# EAGLE design PCA9622DR (EAGLE 7.5.0)
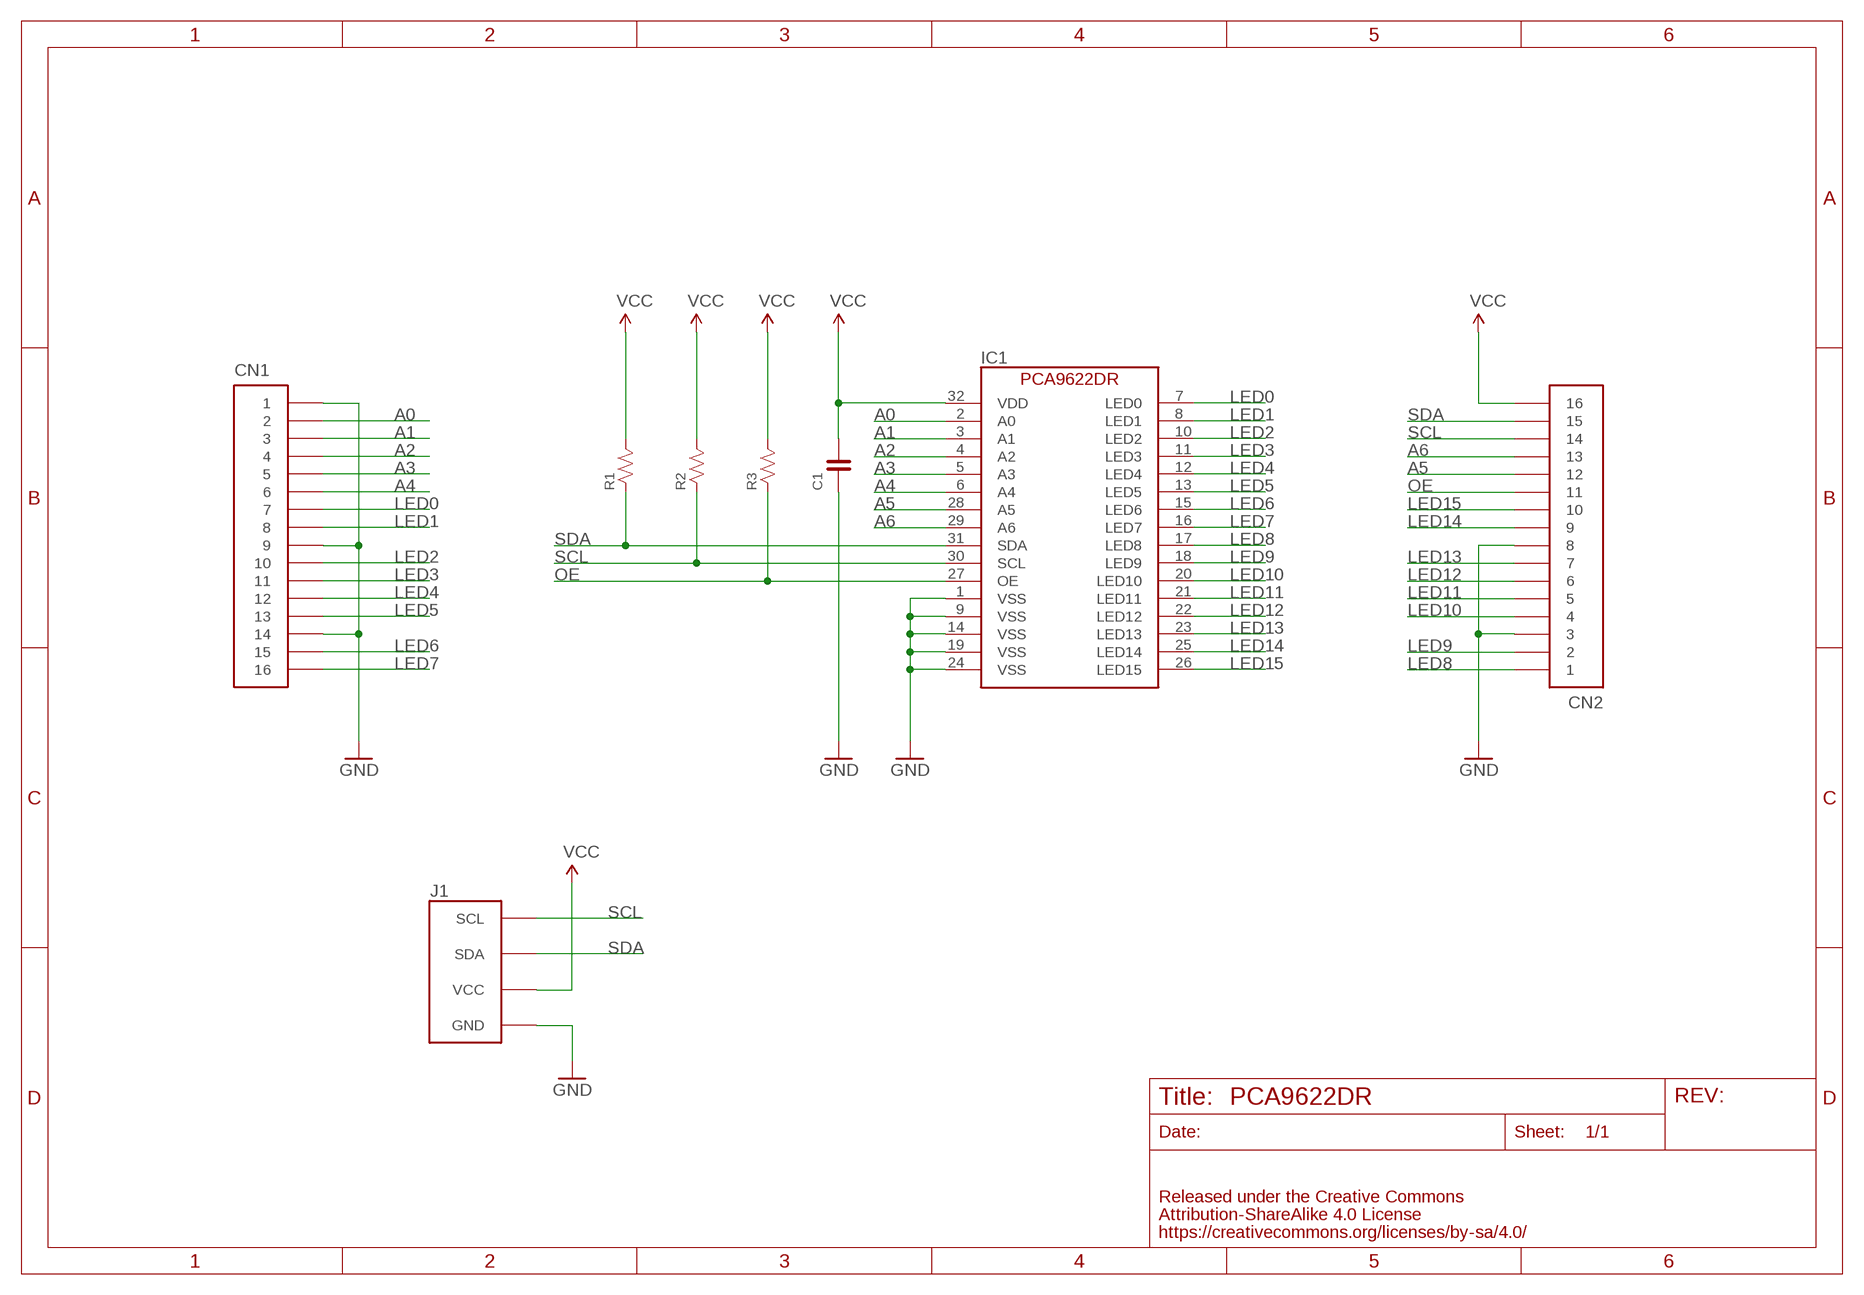
[diagram p0: schematic, sheet 1]

## Parts
C1  CAPACITOR-0603  [0603]
CN1  PIN_HEADER_1X16  [PIN_1X16_SNEAKY]
CN2  PIN_HEADER_1X16  [PIN_1X16_SNEAKY]
IC1  PCA9622DR  [TSSOP32]
J1  FABO_BRICK_I2C-CONNECTOR  [FABO_BRICK_I2C_CONNECTOR]
R1  RESISTOR-0603  [0603]
R2  RESISTOR-0603  [0603]
R3  RESISTOR-0603  [0603]

## Nets
A0: CN1.2 IC1.2(A0)
A1: CN1.3 IC1.3(A1)
A2: CN1.4 IC1.4(A2)
A3: CN1.5 IC1.5(A3)
A4: CN1.6 IC1.6(A4)
A5: CN2.12 IC1.28(A5)
A6: CN2.13 IC1.29(A6)
GND: C1.1 CN1.1 CN1.9 CN1.14 CN2.3 CN2.8 IC1.1(VSS) IC1.9(VSS) IC1.14(VSS) IC1.19(VSS) IC1.24(VSS) J1.GND
LED0: CN1.7 IC1.7(LED0)
LED1: CN1.8 IC1.8(LED1)
LED2: CN1.10 IC1.10(LED2)
LED3: CN1.11 IC1.11(LED3)
LED4: CN1.12 IC1.12(LED4)
LED5: CN1.13 IC1.13(LED5)
LED6: CN1.15 IC1.15(LED6)
LED7: CN1.16 IC1.16(LED7)
LED8: CN2.1 IC1.17(LED8)
LED9: CN2.2 IC1.18(LED9)
LED10: CN2.4 IC1.20(LED10)
LED11: CN2.5 IC1.21(LED11)
LED12: CN2.6 IC1.22(LED12)
LED13: CN2.7 IC1.23(LED13)
LED14: CN2.9 IC1.25(LED14)
LED15: CN2.10 IC1.26(LED15)
OE: CN2.11 IC1.27(OE) R3.1
SCL: CN2.14 IC1.30(SCL) J1.SCL R2.1
SDA: CN2.15 IC1.31(SDA) J1.SDA R1.1
VCC: C1.2 CN2.16 IC1.32(VDD) J1.VCC R1.2 R2.2 R3.2

## Library data of the parts
C1 = FaBo-Capacitor:CAPACITOR: CAPACITOR
CN1 CN2 = FaBo-PIN:PIN_HEADER_1X16
IC1 = FaBo-LED:PCA9622DR
J1 = FaBo-Template:FABO_BRICK_I2C: FaBo Brick I2C
R1-R3 = FaBo-Resistors:RESISTOR: RESISTOR

## Board
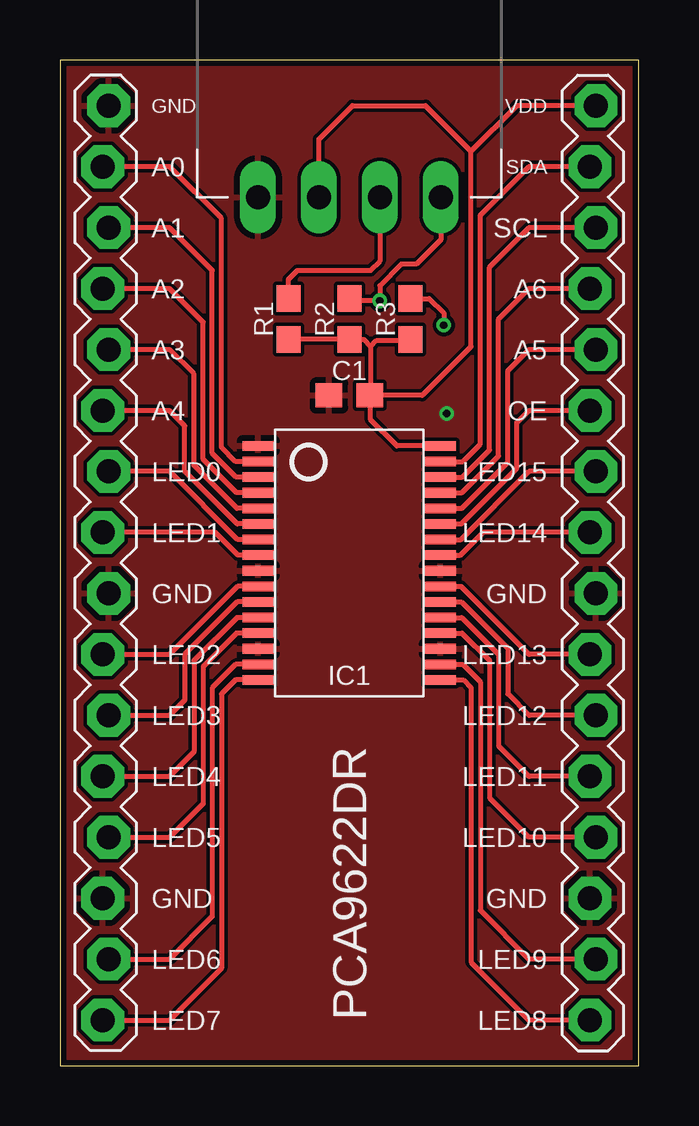
[diagram p1: board, top side]
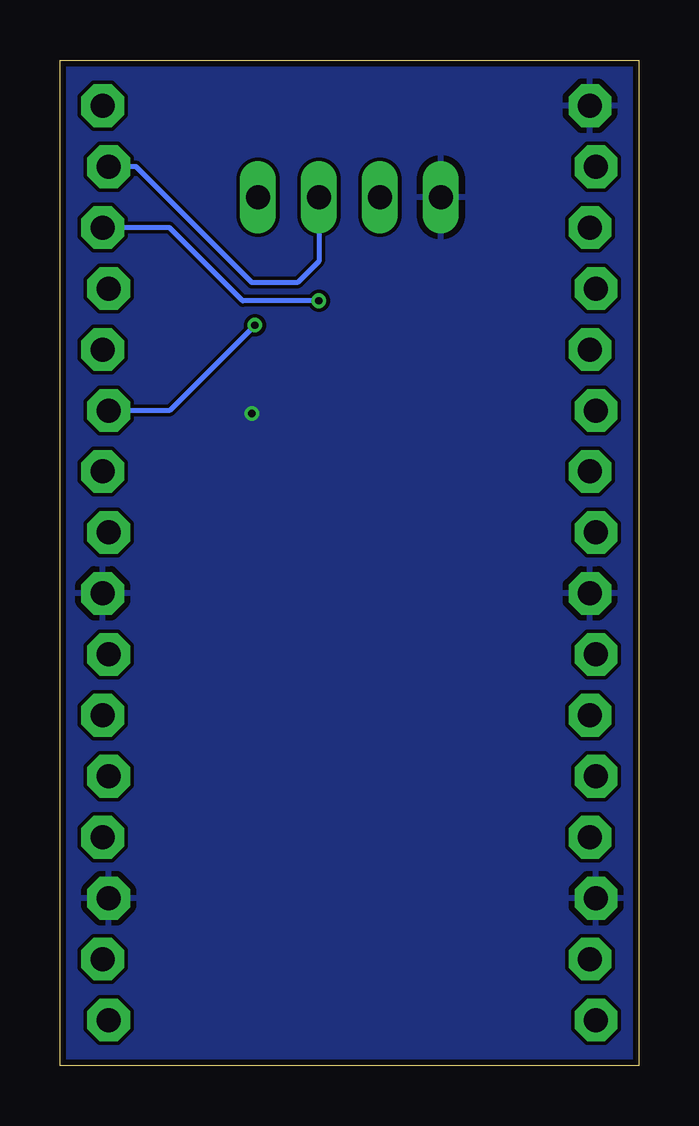
[diagram p2: board, bottom side, seen from below]

Size 24.13 x 41.91 mm. Coordinates in mm from the lower left corner, seen from the top.
Outline: 0,0 24.13,0 24.13,41.91 0,41.91 0,0
Copper layers (1*16): Top 0.035mm / dielectric 1.5mm / Bottom 0.035mm
Design rules "Elecrow_2-layer_eagle_rule": minimum track width 6mil, minimum drill 12mil, track to track 6mil, track to pad 6mil, pad to pad 6mil, via to via 6mil, smd to smd 0mil, copper to edge 10mil, drill to drill 10mil, minimum pad ring 10mil, minimum via ring 6mil, stop-mask expansion 2mil, vias tented up to drill 100mil, thermal gap 10mil

### Footprints (pad centres in the part's own frame; a part is rotated, then mirrored left to right if it is on the bottom)
0603 = smd 1.1 x 1: 1 -0.85,0; 2 0.85,0
PIN_1X16_SNEAKY = drill 1 pad 1.778 octagon: 1 -19.05,0.127; 2 -16.51,-0.127; 3 -13.97,0.127; 4 -11.43,-0.127; 5 -8.89,0.127; 6 -6.35,-0.127; 7 -3.81,0.127; 8 -1.27,-0.127; 9 1.27,0.127; 10 3.81,-0.127; 11 6.35,0.127; 12 8.89,-0.127; 13 11.43,0.127; 14 13.97,-0.127; 15 16.51,0.127; 16 19.05,-0.127
TSSOP32 = smd 1.3 x 0.4: 1 -3.8,4.875; 2 -3.8,4.225; 3 -3.8,3.575; 4 -3.8,2.925; 5 -3.8,2.275; 6 -3.8,1.625; 7 -3.8,0.975; 8 -3.8,0.325; 9 -3.8,-0.325; 10 -3.8,-0.975; 11 -3.8,-1.625; 12 -3.8,-2.275; 13 -3.8,-2.925; 14 -3.8,-3.575; 15 -3.8,-4.225; 16 -3.8,-4.875; 17 3.8,-4.875; 18 3.8,-4.225; 19 3.8,-3.575; 20 3.8,-2.925; 21 3.8,-2.275; 22 3.8,-1.625; 23 3.8,-0.975; 24 3.8,-0.325; 25 3.8,0.325; 26 3.8,0.975; 27 3.8,1.625; 28 3.8,2.275; 29 3.8,2.925; 30 3.8,3.575; 31 3.8,4.225; 32 3.8,4.875
FABO_BRICK_I2C_CONNECTOR = drill 1 long: GND -3.81,0; SCL 3.81,0; SDA 1.27,0; VCC -1.27,0

### Placement (x,y rotation side)
C1  12.06,27.94 0 top
CN1  1.91,20.95 270 top
CN2  22.23,20.95 90 top
IC1  12.06,20.95 0 top
J1  12.06,36.2 0 top
R1  9.53,31.11 270 top
R2  12.06,31.11 270 top
R3  14.61,31.11 270 top

### Tracks (layer width: path | path; a pad name or v marks a point on that pad's centre or on a via)
A0
  Top 0.203: IC1.2 7.33,25.18 6.73,25.78 6.73,35.31 4.57,37.47 CN1.2
A1
  Top 0.203: IC1.3 7.35,24.53 6.35,25.53 6.35,33.15 4.57,34.92 CN1.3
A2
  Top 0.203: IC1.4 7.36,23.88 5.97,25.27 5.97,30.99 4.57,32.38 CN1.4
A3
  Top 0.203: IC1.5 7.38,23.23 5.59,25.02 5.59,28.83 4.57,29.84 CN1.5
A4
  Top 0.203: IC1.6 7.39,22.58 5.21,24.77 5.21,26.67 4.57,27.3 CN1.6
A5
  Top 0.203: CN2.12 19.56,29.84 18.67,28.96 18.67,25.15 16.75,23.23 IC1.28
A6
  Top 0.203: CN2.13 19.56,32.38 18.29,31.11 18.29,25.4 16.77,23.88 IC1.29
GND  (via drill 0.3)
  other vias: 16.13,27.18
  pour Top: -0.64,-0.64 24.77,-0.64 24.77,42.55 -0.64,42.55
  pour Bottom: -0.64,-0.64 24.77,-0.64 24.77,42.55 -0.64,42.55
LED0
  Top 0.203: IC1.7 7.41,21.93 4.57,24.77 CN1.7
LED1
  Top 0.203: IC1.8 7.42,21.28 6.48,22.23 CN1.8
LED2
  Top 0.203: IC1.10 7.41,19.98 4.57,17.14 CN1.10
LED3
  Top 0.203: IC1.11 7.39,19.33 5.21,17.14 5.21,15.24 4.57,14.61 CN1.11
LED4
  Top 0.203: IC1.12 7.38,18.68 5.59,16.89 5.59,13.08 4.57,12.06 CN1.12
LED5
  Top 0.203: IC1.13 7.36,18.03 5.97,16.64 5.97,10.92 4.57,9.53 CN1.13
LED6
  Top 0.203: IC1.15 7.33,16.73 6.35,15.75 6.35,6.22 4.57,4.45 CN1.15
LED7
  Top 0.203: IC1.16 7.32,16.08 6.73,15.49 6.73,4.06 4.57,1.91 CN1.16
LED8
  Top 0.203: CN2.1 19.56,1.91 17.14,4.32 17.14,15.75 16.81,16.08 IC1.17
LED9
  Top 0.203: CN2.2 19.56,4.45 17.53,6.48 17.53,16 16.8,16.73 IC1.18
LED10
  Top 0.203: CN2.4 19.56,9.53 17.91,11.18 17.91,16.89 16.77,18.03 IC1.20
LED11
  Top 0.203: CN2.5 19.56,12.06 18.29,13.34 18.29,17.14 16.75,18.68 IC1.21
LED12
  Top 0.203: CN2.6 19.56,14.61 18.67,15.49 18.67,17.4 16.74,19.33 IC1.22
LED13
  Top 0.203: CN2.7 19.56,17.14 16.72,19.98 IC1.23
LED14
  Top 0.203: CN2.9 17.65,22.23 16.71,21.28 IC1.25
LED15
  Top 0.203: CN2.10 19.56,24.77 16.72,21.93 IC1.26
OE  (via drill 0.3)
  Top 0.203: CN2.11 19.56,27.3 19.05,26.8 19.05,24.89 16.74,22.58 IC1.27 | R3.1 15.41,31.96 16,31.37 v16,30.86
  Bottom 0.203: v16,30.86 19.56,27.3 CN2.11
SCL  (via drill 0.3)
  Top 0.203: CN2.14 19.56,34.92 17.91,33.27 17.91,25.65 16.78,24.53 IC1.30 | J1.SCL 15.88,34.42 14.86,33.4 14.22,33.4 13.34,32.51 v13.34,31.88 12.15,31.88 R2.1
  Bottom 0.203: v13.34,31.88 16.51,31.88 19.56,34.92 CN2.14
SDA
  Top 0.203: CN2.15 19.56,37.47 17.53,35.43 17.53,25.91 16.8,25.18 IC1.31 | J1.SDA 13.34,33.53 12.95,33.15 9.91,33.15 9.53,32.77 R1.1
  Bottom 0.203: J1.SDA 13.34,33.53 14.22,32.64 16.13,32.64 20.95,37.47 CN2.15
VCC
  Top 0.203: CN2.16 19.05,40.01 17.14,38.1 | 17.14,38.1 17.14,29.97 15.11,27.94 C1.2 | IC1.32 14.05,25.83 12.95,26.92 12.95,27.9 C1.2 | J1.VCC 10.79,38.61 12.19,40.01 15.24,40.01 17.14,38.1 | 12.95,29.97 12.66,30.27 R2.2 R1.2 | 12.95,29.97 12.95,27.98 C1.2 | 12.95,29.97 13.21,30.23 14.57,30.23 R3.2

### Text on the board
tPlace: GND | VDD | A0 | SDA | A1 | SCL | A2 | A6 | A3 | A5 | A4 | OE | LED0 | LED15 | LED1 | LED14 | GND | GND | LED2 | LED13 | LED3 | LED12 | LED4 | LED11 | LED5 | LED10 | GND | GND | LED6 | LED9 | LED7 | PCA9622DR | LED8